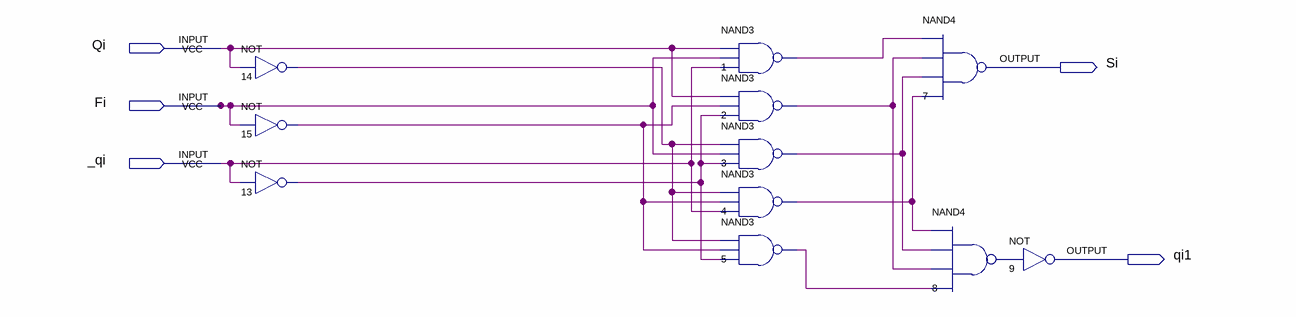
[diagram p0: schematic sheet]
// Quartus schematic sum.bdf as structural Verilog: 11 symbols, 5 pins
module sum (
  input  Qi,
  input  Fi,
  input  _qi,
  output Si,
  output qi1
);

  wire n1_out, n2_out, n3_out, n4_out, n5_out, n8_out, n13_out, n14_out, n15_out;

  not u_14 (n14_out, Qi);
  not u_15 (n15_out, Fi);
  not u_13 (n13_out, _qi);
  nand u_1 (n1_out, Qi, Fi, _qi);
  nand u_2 (n2_out, Qi, n15_out, n13_out);
  nand u_3 (n3_out, n14_out, Fi, n13_out);
  nand u_4 (n4_out, n14_out, n15_out, _qi);
  nand u_5 (n5_out, n14_out, n15_out, n13_out);
  nand u_7 (Si, n1_out, n2_out, n3_out, n4_out);
  nand u_8 (n8_out, n4_out, n3_out, n2_out, n5_out);
  not u_9 (qi1, n8_out);
endmodule
